# EAGLE design Scott_Beck_PIC32_Schematic (EAGLE 8.1.0)
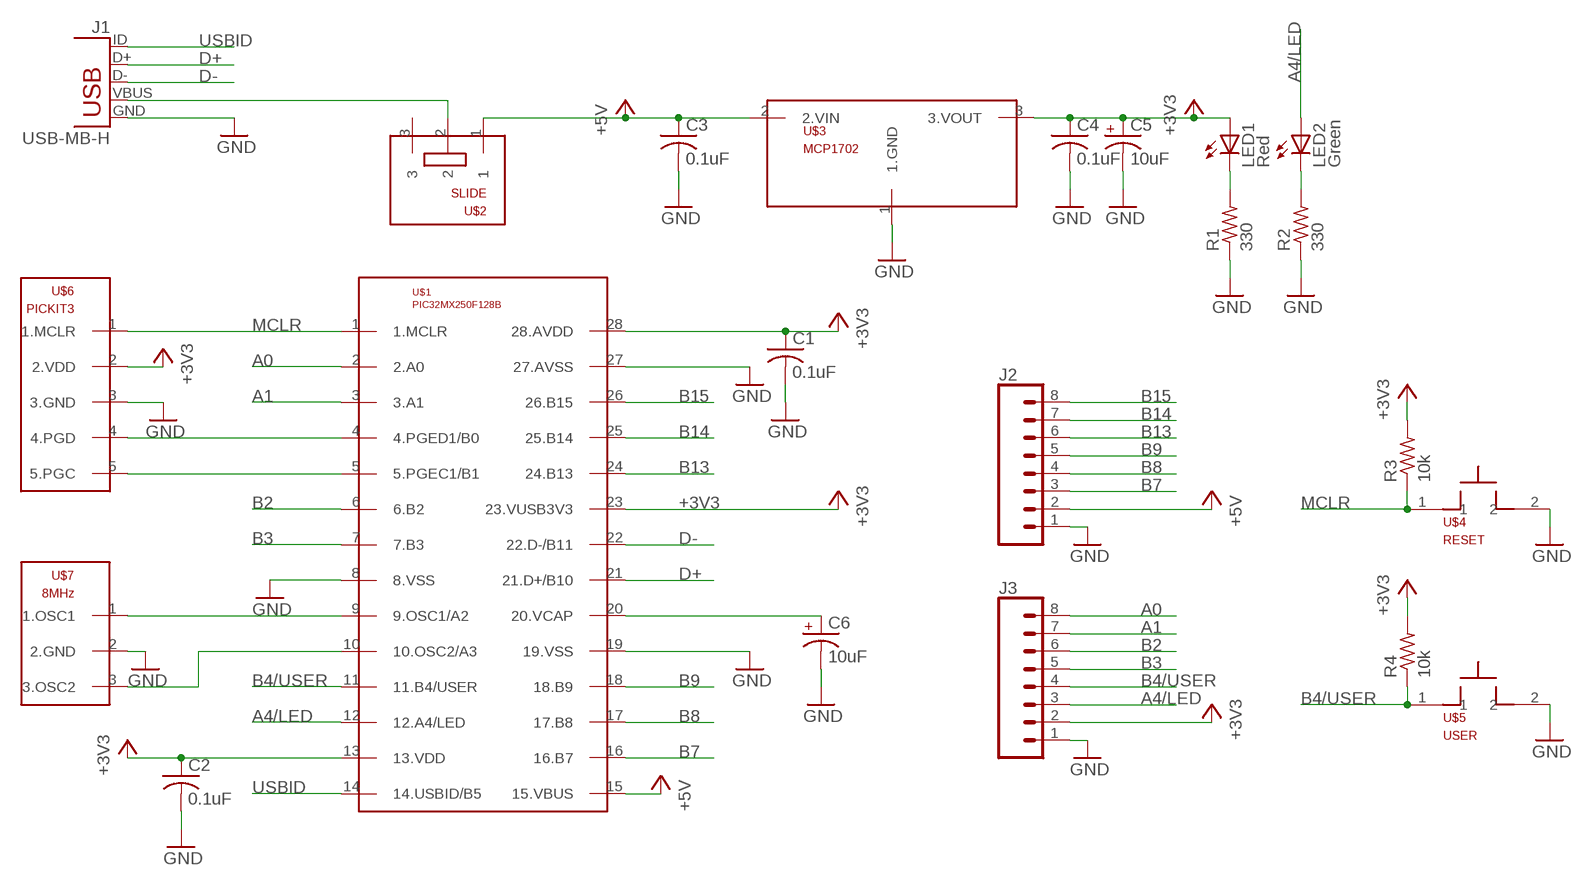
[diagram p0: schematic, sheet 1]

## Parts
C1  0.1uF  C-USC0603  [C0603]
C2  0.1uF  C-USC0603  [C0603]
C3  0.1uF  C-USC0603  [C0603]
C4  0.1uF  C-USC0603  [C0603]
C5  10uF  C-USC0603  [C0603]
C6  10uF  C-USC0603  [C0603]
J1  USB-MB-H  [USB-MB-H]
J2  CONN_08"  [1X08]
J3  CONN_08"  [1X08]
LED1  Red  LEDSML0603  [SML0603]
LED2  Green  LEDSML0603  [SML0603]
R1  330  R-US_R0603  [R0603]
R2  330  R-US_R0603  [R0603]
R3  10k  R-US_R0603  [R0603]
R4  10k  R-US_R0603  [R0603]
U$1  PIC32MX250F128B  [DIL28-3]
U$2  SLIDE  [SLIDE]
U$3  MCP1702  [TO92]
U$4  RESET  PB  [PB]
U$5  USER  PB  [PB]
U$6  PICKIT3  [PICKIT3]
U$7  8MHz  OSC  [OSC]

## Nets
+3V3: C1.1 C2.1 C4.1 C5.1 J3.2 LED1.A R3.2 R4.2 U$1.13(13.VDD) U$1.23(23.VUSB3V3) U$1.28(28.AVDD) U$3.3(3.VOUT) U$6.2(2.VDD)
+5V: C3.1 J2.2 U$1.15(15.VBUS) U$2.1 U$3.2(2.VIN)
A0: J3.8 U$1.2(2.A0)
A1: J3.7 U$1.3(3.A1)
A4/LED: J3.3 LED2.A U$1.12(12.A4/LED)
B2: J3.6 U$1.6(6.B2)
B3: J3.5 U$1.7(7.B3)
B4/USER: J3.4 R4.1 U$1.11(11.B4/USER) U$5.1
B7: J2.3 U$1.16(16.B7)
B8: J2.4 U$1.17(17.B8)
B9: J2.5 U$1.18(18.B9)
B13: J2.6 U$1.24(24.B13)
B14: J2.7 U$1.25(25.B14)
B15: J2.8 U$1.26(26.B15)
D+: J1.D+ U$1.21(21.D+/B10)
D-: J1.D- U$1.22(22.D-/B11)
GND: C1.2 C2.2 C3.2 C4.2 C5.2 C6.2 J1.GND J2.1 J3.1 R1.1 R2.1 U$1.8(8.VSS) U$1.19(19.VSS) U$1.27(27.AVSS) U$3.1(1.GND) U$4.2 U$5.2 U$6.3(3.GND) U$7.2(2.GND)
MCLR: R3.1 U$1.1(1.MCLR) U$4.1 U$6.1(1.MCLR)
N$1: J1.VBUS U$2.2
N$2: U$1.9(9.OSC1/A2) U$7.1(1.OSC1)
N$3: LED1.C R1.2
N$4: U$1.10(10.OSC2/A3) U$7.3(3.OSC2)
N$5: C6.1 U$1.20(20.VCAP)
N$6: LED2.C R2.2
PGC: U$1.5(5.PGEC1/B1) U$6.5(5.PGC)
PGD: U$1.4(4.PGED1/B0) U$6.4(4.PGD)
USBID: J1.ID U$1.14(14.USBID/B5)
Unconnected: U$2.3

## Library data of the parts
C1-C6 = resistor:C-US: CAPACITOR, American symbol
J1 = Scott_Beck_PIC32_Library:USB: USB Connectors USB-B-PTH is fully proven SKU : PRT-00139/CONN-08278 USB-miniB is fully proven SKU : PRT-00587 USB-A-PCB is untested. USB-A-H is throughly reviewed, but untested. Spark Fun Electronics SKU : PRT-00437 USB-B-SMT is throughly reviewed, but untested. Needs silkscreen touching up. USB-A-S has not been used/tested USB-MB-H has not been used/tested USB-MICROB has been used. CONN-09505
J2 J3 = Scott_Beck_PIC32_Library:CONN_08: Multi connection point. Often used as Generic Header-pin footprint for 0.1 inch spaced/style header connections On any of the 0.1 inch spaced packages, you can populate with these: Break Away Headers - Straight <https://www.sparkfun.com/products/116> (PRT-00116) Break Away Male Headers - Right Angle <https://www.sparkfun.com/products/553> (PRT-00553) Female Headers <https://www.sparkfun.com/products/115> (PRT-00115) Break Away Headers - Machine Pin <https://www.sparkfun.com/products/117> (PRT-00117) Break Away Female Headers - Swiss Machine Pin <https://www.sparkfun.com/products/743> (PRT-00743) Arduino Stackable Header - 8 Pin <https://www.sparkfun.com/products/9279> (PRT-09279) For SCREWTERMINALS and SPRING TERMINALS visit here: Screw Terimnals on SparkFun.com <https://www.sparkfun.com/search/results?term=Screw+Terminals> (5mm/3.5mm/2.54mm spacing) This device is also useful as a general connection point to wire up your design to another part of your project. Our various solder wires solder well into these plated through hole pads. Hook-Up Wire - Assortment (Stranded, 22 AWG) <https://www.sparkfun.com/products/11375> (PRT-11375) Hook-Up Wire - Assortment (Solid Core, 22 AWG) <https://www.sparkfun.com/products/11367> (PRT-11367) View the entire wire category on our website here <https://www.sparkfun.com/categories/141> Special notes: Molex polarized connector foot print use with SKU : PRT-08231 with associated crimp pins and housings. 1MM SMD Version SKU: PRT-10208 NOTES ON THE VARIANTS LOCK and LOCK_LONGPADS... This footprint was designed to help hold the alignment of a through-hole component (i.e. 6-pin header) while soldering it into place. You may notice that each hole has been shifted either up or down by 0.005 of an inch from it's more standard position (which is a perfectly straight line). This slight alteration caused the pins (the squares in the middle) to touch the edges of the holes. Because they are alternating, it causes a "brace" to hold the component in place. 0.005 has proven to be the perfect amount of "off-center" position when using our standard breakaway headers. Although looks a little odd when you look at the bare footprint, once you have a header in there, the alteration is very hard to notice. Also,if you push a header all the way into place, it is covered up entirely on the bottom side.; PROD_ID: CONN-08438
LED1 LED2 = led:LED: LED OSRAM: - CHIPLED LG R971, LG N971, LY N971, LG Q971, LY Q971, LO R971, LY R971 LH N974, LH R974 LS Q976, LO Q976, LY Q976 LO Q996 - Hyper CHIPLED LW Q18S LB Q993, LB Q99A, LB R99A - SideLED LS A670, LO A670, LY A670, LG A670, LP A670 LB A673, LV A673, LT A673, LW A673 LH A674 LY A675 LS A676, LA A676, LO A676, LY A676, LW A676 LS A679, LY A679, LG A679 - Hyper Micro SIDELED® LS Y876, LA Y876, LO Y876, LY Y876 LT Y87S - SmartLED LW L88C, LW L88S LB L89C, LB L89S, LG L890 LS L89K, LO L89K, LY L89K LS L896, LA L896, LO L896, LY L896 - TOPLED LS T670, LO T670, LY T670, LG T670, LP T670 LSG T670, LSP T670, LSY T670, LOP T670, LYG T670 LG T671, LOG T671, LSG T671 LB T673, LV T673, LT T673, LW T673 LH T674 LS T676, LA T676, LO T676, LY T676, LB T676, LH T676, LSB T676, LW T676 LB T67C, LV T67C, LT T67C, LS T67K, LO T67K, LY T67K, LW E67C LS E67B, LA E67B, LO E67B, LY E67B, LB E67C, LV E67C, LT E67C LW T67C LS T679, LY T679, LG T679 LS T770, LO T770, LY T770, LG T770, LP T770 LB T773, LV T773, LT T773, LW T773 LH T774 LS E675, LA E675, LY E675, LS T675 LS T776, LA T776, LO T776, LY T776, LB T776 LHGB T686 LT T68C, LB T68C - Hyper Mini TOPLED® LB M676 - Mini TOPLED Santana® LG M470 LS M47K, LO M47K, LY M47K Source: http://www.osram.convergy.de LUXEON: - LUMILED® LXK2-PW12-R00, LXK2-PW12-S00, LXK2-PW14-U00, LXK2-PW14-V00 LXK2-PM12-R00, LXK2-PM12-S00, LXK2-PM14-U00 LXK2-PE12-Q00, LXK2-PE12-R00, LXK2-PE12-S00, LXK2-PE14-T00, LXK2-PE14-U00 LXK2-PB12-K00, LXK2-PB12-L00, LXK2-PB12-M00, LXK2-PB14-N00, LXK2-PB14-P00, LXK2-PB14-Q00 LXK2-PR12-L00, LXK2-PR12-M00, LXK2-PR14-Q00, LXK2-PR14-R00 LXK2-PD12-Q00, LXK2-PD12-R00, LXK2-PD12-S00 LXK2-PH12-R00, LXK2-PH12-S00 LXK2-PL12-P00, LXK2-PL12-Q00, LXK2-PL12-R00 Source: www.luxeon.com KINGBRIGHT: KA-3528ASYC Source: www.kingbright.com
R1-R4 = resistor:R-US_: RESISTOR, American symbol
U$1 = Scott_Beck_PIC32_Library:PIC32MX250F128B
U$2 = Scott_Beck_PIC32_Library:SLIDE
U$3 = Scott_Beck_PIC32_Library:MCP1702
U$4 U$5 = Scott_Beck_PIC32_Library:PB
U$6 = Scott_Beck_PIC32_Library:PICKIT3
U$7 = Scott_Beck_PIC32_Library:OSC

## Board
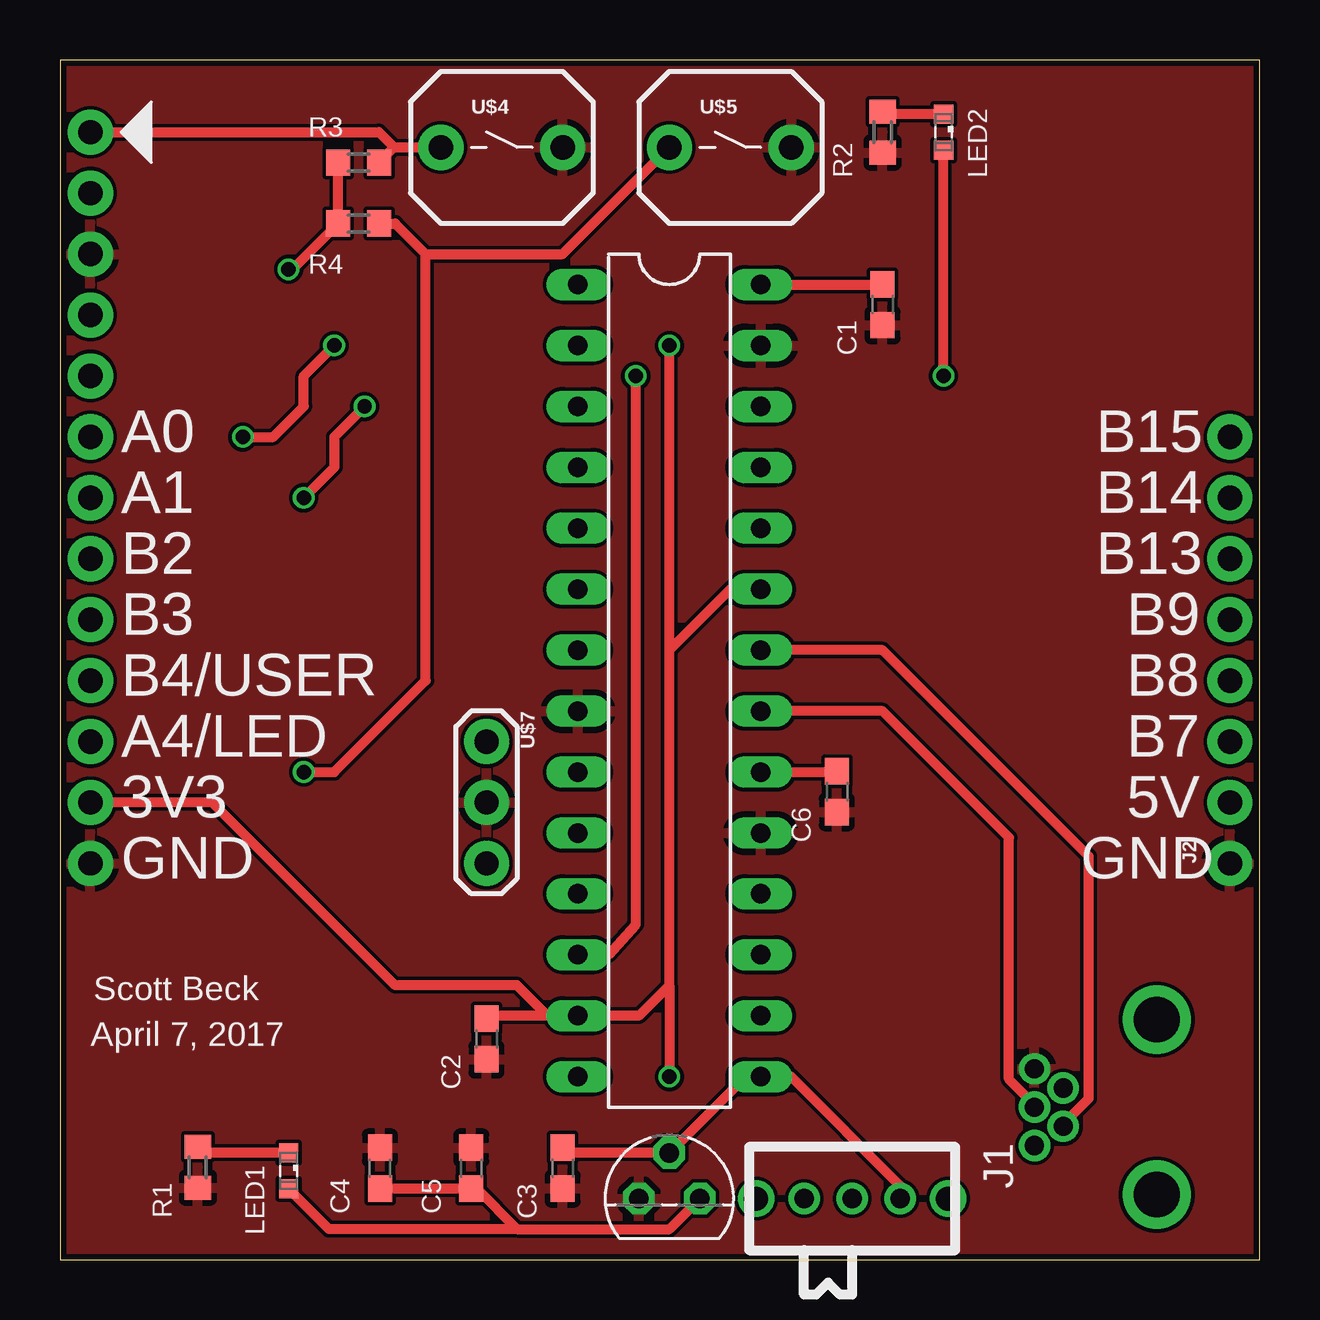
[diagram p1: board, top side]
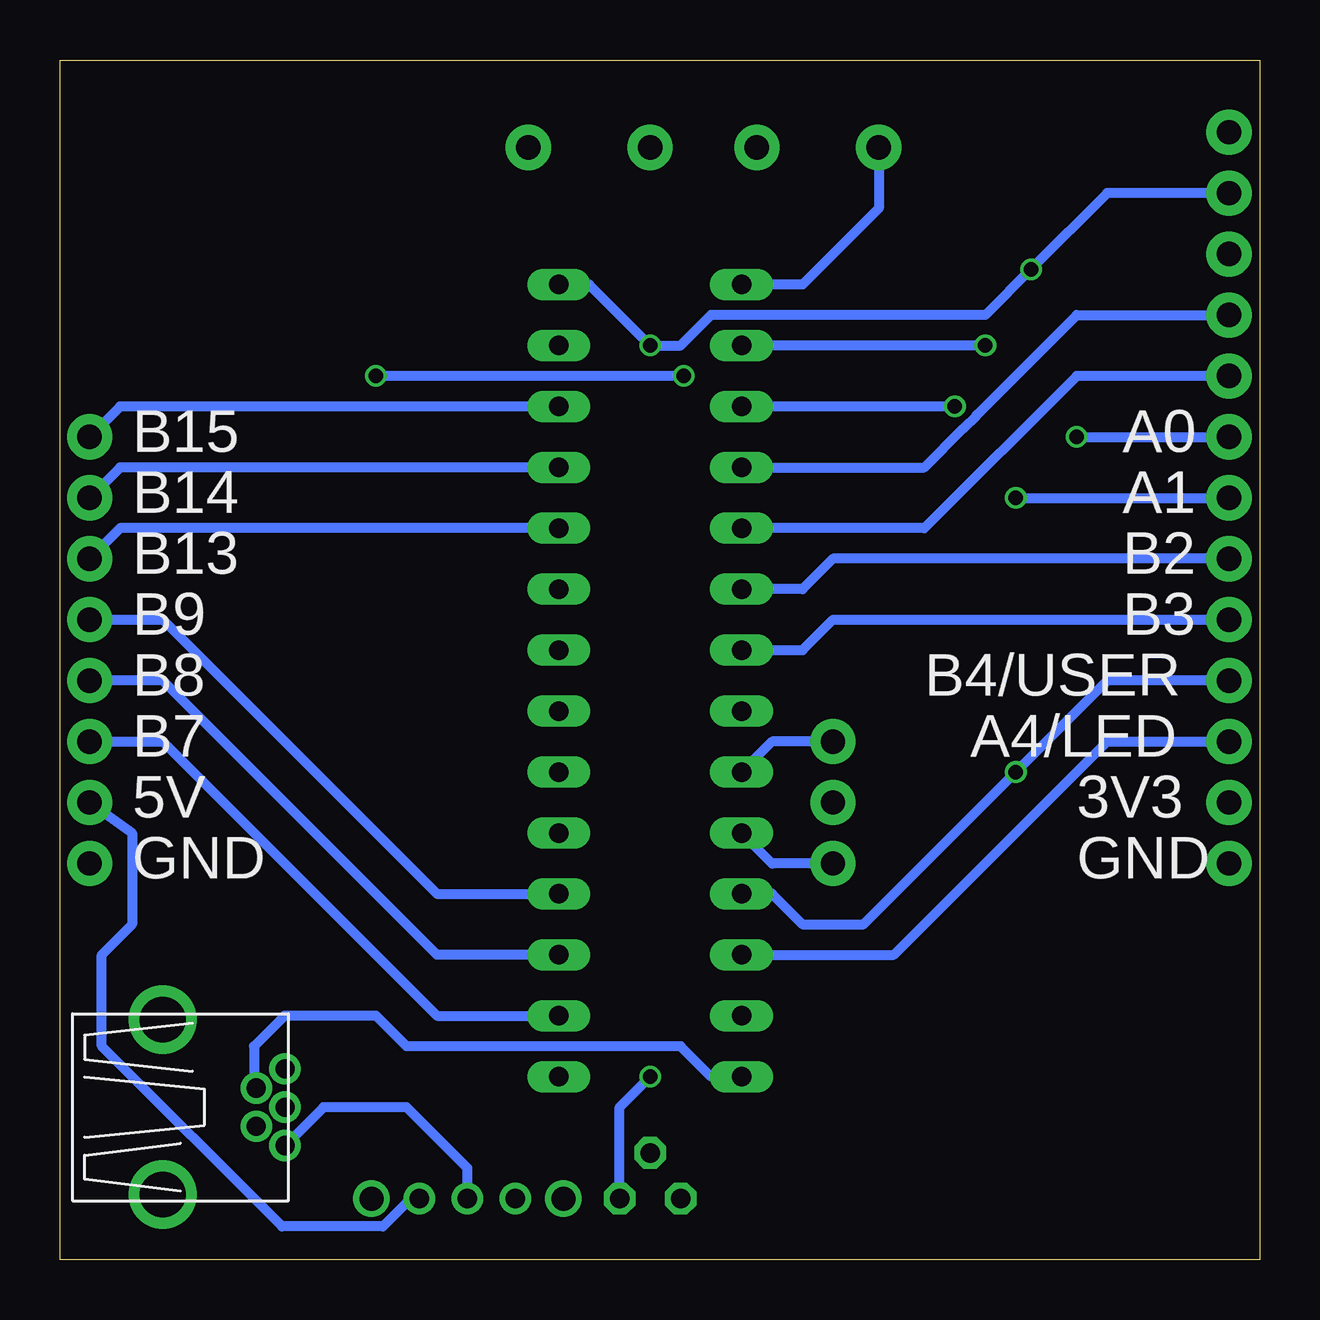
[diagram p2: board, bottom side, seen from below]

Size 50 x 50 mm. Coordinates in mm from the lower left corner, seen from the top.
Outline: 0,0 50,0 50,50 0,50 0,0
Copper layers (1*16): Top 0.035mm / dielectric 1.5mm / Bottom 0.035mm
Design rules "SeeedStudio_2layer_DRU_no_angle_20140221": minimum track width 6mil, minimum drill 12mil, track to track 6mil, track to pad 6mil, pad to pad 6mil, via to via 6mil, smd to smd 0mil, copper to edge 10mil, drill to drill 10mil, minimum pad ring 10mil, minimum via ring 6mil, stop-mask expansion 2mil, vias tented up to drill 100mil, thermal gap 10mil

### Footprints (pad centres in the part's own frame; a part is rotated, then mirrored left to right if it is on the bottom)
C0603 = smd 1.1 x 1: 1 -0.85,0; 2 0.85,0
USB-MB-H = drill 0.8: D+ 5.1,0; D- 3.9,0.8; GND 5.1,-1.6; ID 3.9,-0.8; VBUS 5.1,1.6 | drill 1.9: P$6 0,-3.65; P$7 0,3.65
1X08 = drill 1.016 pad 1.88: 1 0,0; 2 2.54,0; 3 5.08,0; 4 7.62,0; 5 10.16,0; 6 12.7,0; 7 15.24,0; 8 17.78,0
SML0603 = smd 0.8 x 0.8: A 0.75,0; C -0.75,0
R0603 = smd 1 x 1.1: 1 -0.85,0; 2 0.85,0
DIL28-3 = drill 0.813 long: 1 -16.51,-3.81; 2 -13.97,-3.81; 3 -11.43,-3.81; 4 -8.89,-3.81; 5 -6.35,-3.81; 6 -3.81,-3.81; 7 -1.27,-3.81; 8 1.27,-3.81; 9 3.81,-3.81; 10 6.35,-3.81; 11 8.89,-3.81; 12 11.43,-3.81; 13 13.97,-3.81; 14 16.51,-3.81; 15 16.51,3.81; 16 13.97,3.81; 17 11.43,3.81; 18 8.89,3.81; 19 6.35,3.81; 20 3.81,3.81; 21 1.27,3.81; 22 -1.27,3.81; 23 -3.81,3.81; 24 -6.35,3.81; 25 -8.89,3.81; 26 -11.43,3.81; 27 -13.97,3.81; 28 -16.51,3.81
SLIDE = drill 0.8: 1 -2,0; 2 0,0; 3 2,0 | drill 1: P$1 -4,0; P$2 4,0
TO92 = drill 0.813 octagon: 1 -1.27,0; 2 0,1.905; 3 1.27,0
PB = drill 1.016 pad 1.88: 1 -2.54,0; 2 2.54,0
PICKIT3 = drill 1.016 pad 1.88: 1 -5.08,0; 2 -2.54,0; 3 0,0; 4 2.54,0; 5 5.08,0
OSC = drill 1.016 pad 1.88: 1 -2.54,0; 2 0,0; 3 2.54,0

### Placement (x,y rotation side)
C1  34.29,39.8 270 top
C2  17.78,9.2 270 top
C3  20.95,3.81 270 top
C4  13.34,3.81 90 top
C5  17.14,3.81 90 top
C6  32.38,19.5 270 top
J1  45.72,6.35 180 top
J2  48.77,16.51 90 top
J3  1.27,16.51 90 top
LED1  9.54,3.7 270 top
LED2  36.83,46.99 270 top
R1  5.75,3.84 90 top
R2  34.29,46.99 90 top
R3  12.45,45.72 180 top
R4  12.45,43.18 180 top
U$1  25.4,24.13 270 top
U$2  33.02,2.54 180 top
U$3  25.4,2.54 0 top
U$4  18.41,46.35 0 top
U$5  27.94,46.35 0 top
U$6  1.27,41.91 270 top
U$7  17.78,19.05 270 top

### Tracks (layer width: path | path; a pad name or v marks a point on that pad's centre or on a via)
+3V3  (via drill 0.6)
  Top 0.406: U$3.3 25.4,1.27 19.05,1.27 | C4.1 C5.1 17.36,2.96 19.05,1.27 | 25.4,11.43 v25.4,7.62 | 25.4,11.43 25.4,25.4 | 25.4,25.4 27.94,27.94 U$1.23 | 25.4,11.43 24.13,10.16 U$1.13 20.32,10.16 | 20.32,10.16 18.2,10.16 C2.1 | 25.4,25.4 v25.4,38.1 | C1.1 33.87,40.64 U$1.28 | R3.2 R4.2 9.7,41.27 v9.53,41.27 | 19.05,1.27 11.21,1.27 LED1.A | 20.32,10.16 19.05,11.43 13.97,11.43 6.35,19.05 J3.2
  Bottom 0.406: U$3.3 26.67,6.35 v25.4,7.62 | U$1.28 27.94,40.64 v25.4,38.1 24.13,38.1 22.86,39.37 11.43,39.37 v9.53,41.27 6.35,44.45 U$6.2
+5V
  Top 0.406: U$2.1 35.02,3.08 30.48,7.62 U$1.15 28.57,7.62 U$3.2 21.17,4.45 C3.1
  Bottom 0.406: J2.2 46.99,17.78 46.99,13.97 48.26,12.7 48.26,8.89 40.75,1.38 36.54,1.38 35.38,2.54 U$2.1
A0  (via drill 0.6)
  Top 0.406: v11.43,38.1 10.16,36.83 10.16,35.56 8.89,34.29 v7.62,34.29
  Bottom 0.406: v11.43,38.1 U$1.2 | v7.62,34.29 J3.8
A1  (via drill 0.6)
  Top 0.406: v12.7,35.56 11.43,34.29 11.43,33.02 v10.16,31.75
  Bottom 0.406: v12.7,35.56 U$1.3 | v10.16,31.75 J3.7
A4/LED  (via drill 0.6)
  Top 0.406: U$1.12 22.86,12.7 24,13.97 v24,36.83 | v36.83,36.83 LED2.A
  Bottom 0.406: U$1.12 15.24,12.7 6.35,21.59 J3.3 | v24,36.83 v36.83,36.83
B2
  Bottom 0.406: J3.6 17.78,29.21 19.05,27.94 U$1.6
B3
  Bottom 0.406: U$1.7 19.05,25.4 17.78,26.67 J3.5
B4/USER  (via drill 0.6)
  Top 0.406: R4.1 13.97,43.18 15.24,41.91 | 15.24,41.91 20.95,41.91 U$5.1 | v10.16,20.32 11.43,20.32 15.24,24.13 15.24,41.91
  Bottom 0.406: U$1.11 20.32,15.24 19.05,13.97 16.51,13.97 v10.16,20.32 6.35,24.13 J3.4
B7
  Bottom 0.406: J2.3 45.72,21.59 34.29,10.16 U$1.16
B8
  Bottom 0.406: U$1.17 34.29,12.7 45.72,24.13 J2.4
B9
  Bottom 0.406: J2.5 45.72,26.67 34.29,15.24 U$1.18
B13
  Bottom 0.406: U$1.24 47.5,30.48 J2.6
B14
  Bottom 0.406: U$1.25 47.5,33.02 J2.7
B15
  Bottom 0.406: U$1.26 47.5,35.56 J2.8
D+
  Top 0.406: U$1.21 34.29,22.86 39.56,17.59 39.56,7.51 40.62,6.45 J1.D+
D-
  Top 0.406: U$1.22 34.29,25.4 42.88,16.81 42.88,6.71 41.82,5.65 J1.D-
GND
  pour Top: 0,50 50,50 50,0 0,0
MCLR
  Top 0.406: 13.94,46.35 U$4.1 | 13.94,46.35 R3.1 | 13.94,46.35 13.3,46.99 U$6.1
  Bottom 0.406: U$4.1 15.88,43.81 19.05,40.64 U$1.1
N$1
  Bottom 0.406: U$2.2 33.02,3.81 35.56,6.35 39.02,6.35 J1.VBUS
N$2
  Bottom 0.406: U$7.1 20.32,21.59 U$1.9
N$3
  Top 0.406: LED1.C 5.99,4.45 R1.2
N$4
  Bottom 0.406: U$7.3 20.32,16.51 U$1.10
N$5
  Top 0.406: U$1.20 32.35,20.32 C6.1
N$6
  Top 0.406: LED2.C 34.39,47.74 R2.2
PGC
  Bottom 0.406: U$6.5 7.62,36.83 13.97,30.48 U$1.5
PGD
  Bottom 0.406: U$1.4 13.97,33.02 12.34,34.65 12.32,34.65 11.79,35.18 11.79,35.2 7.62,39.37 U$6.4
USBID
  Bottom 0.406: U$1.14 22.86,7.62 24.13,8.89 35.56,8.89 36.83,10.16 40.64,10.16 41.91,8.89 41.91,7.24 J1.ID

### Text on the board
tPlace: A0 | B15 | A1 | B14 | B2 | B13 | B3 | B9 | B4/USER | B8 | A4/LED | B7 | 3V3 | 5V | GND | GND | Scott Beck | April 7, 2017
bPlace: A0 | B15 | A1 | B14 | B2 | B13 | B3 | B9 | B4/USER | B8 | A4/LED | B7 | 3V3 | 5V | GND | GND